# EAGLE design 12V_PowerSupply_V01 (EAGLE 9.2.0)
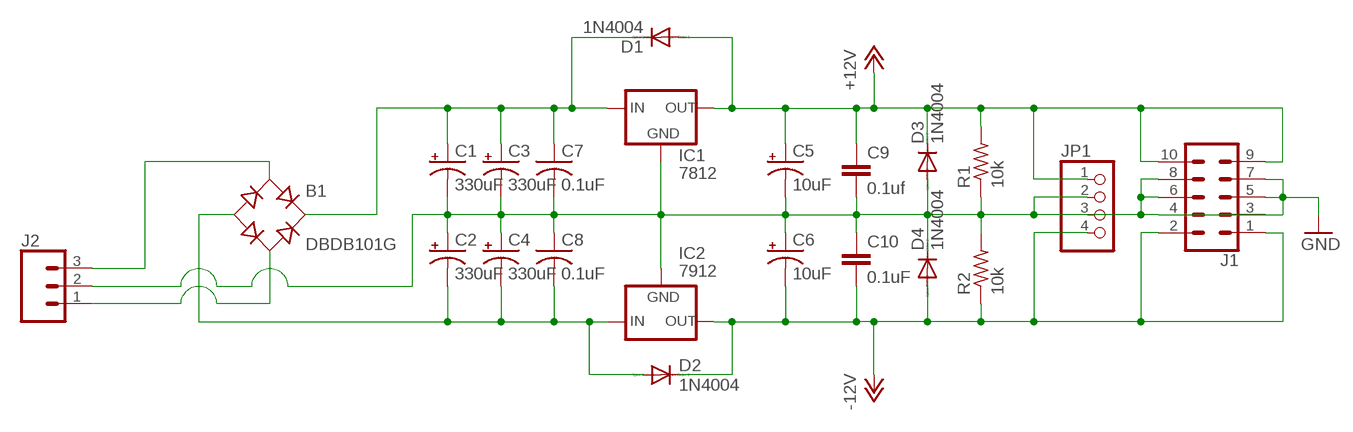
[diagram p0: schematic, sheet 1]

## Parts
B1  DBDB101G  [DB]
C1  330uF  CPOL-USE7.5-18  [E7,5-18]
C2  330uF  CPOL-USE7.5-18  [E7,5-18]
C3  330uF  CPOL-USE7.5-18  [E7,5-18]
C4  330uF  CPOL-USE7.5-18  [E7,5-18]
C5  10uF  CPOL-USE2.5-7  [E2,5-7]
C6  10uF  CPOL-USE2.5-7  [E2,5-7]
C7  0.1uF  C-US150-054X183  [C150-054X183]
C8  0.1uF  C-US150-054X183  [C150-054X183]
C9  0.1uf  C-EU050-025X075  [C050-025X075]
C10  0.1uF  C-EU050-025X075  [C050-025X075]
D1  1N4004  [DO41-10]
D2  1N4004  [DO41-10]
D3  1N4004  [DO41-10]
D4  1N4004  [DO41-10]
IC1  7812  78XXS  [78XXS]
IC2  7912  79XXS  [79XXS]
J1  CONN_05X2SHD  [2X5-SHROUDED]
J2  CONN_03-SCREW-5MM  [SCREWTERMINAL-5MM-3]
JP1  PINHD-1X4  [1X04]
R1  10k  R-US_0204/7  [0204/7]
R2  10k  R-US_0204/7  [0204/7]

## Nets
+12V: C5.+ C9.1 D1.A D3.C IC1.OUT J1.9 J1.10 JP1.1 R1.2
-12V: C6.- C10.2 D2.C D4.A IC2.OUT J1.1 J1.2 JP1.4 R2.1
GND: C1.- C2.+ C3.- C4.+ C5.- C6.+ C7.2 C8.1 C9.2 C10.1 D3.A D4.C IC1.GND IC2.GND J1.3 J1.4 J1.5 J1.6 J1.7 J1.8 J2.2 JP1.2 JP1.3 R1.1 R2.2
N$2: B1.+ C1.+ C3.+ C7.1 D1.C IC1.IN
N$3: B1.- C2.- C4.- C8.2 D2.A IC2.IN
N$4: B1.AC1 J2.3
N$5: B1.AC2 J2.1

## Library data of the parts
B1 = rectifier:DB?*G: Single Phase 1.0 AMP Glass Passivated Bridge Rectifier Taiwan Semiconductor Co.,Ltd. - TSC Source: http://www.taiwansemi.com/TSCbig5/ezcatfiles/cust/img/img/db101g.pdf http://www.ts.com.tw/db/pictures/modules/PDT/PDT060207001/DBLS201G.pdf
C1-C6 = rcl:CPOL-US: POLARIZED CAPACITOR, American symbol; SPICEPREFIX: C
C7 C8 = rcl:C-US: CAPACITOR, American symbol; SPICEPREFIX: C
C9 C10 = rcl:C-EU: CAPACITOR, European symbol; SPICEPREFIX: C
D1-D4 = diode:1N4004: DIODE general purpose rectifier, 1 A
IC1 = v-reg:78XXS: VOLTAGE REGULATOR
IC2 = v-reg:79XXS: VOLTAGE REGULATOR
J1 = SparkFun-Connectors:CONN_05X2: Multi connection point. Often used as Generic Header-pin footprint for 0.1 inch spaced/style header connections For AVR SPI programming port, see special device with nice symbol: "AVR_SPI_PROG_5x2.dev" You can populate with any combo of single row headers, but if you'd like an exact match, check these: 2x5 AVR ICSP Male Header <https://www.sparkfun.com/products/778> (PRT-00778) 2x5 Pin Shrouded Header <https://www.sparkfun.com/products/8506> (PRT-08506) On any of the 0.1 inch spaced packages, you can populate with these: Break Away Headers - Straight <https://www.sparkfun.com/products/116> (PRT-00116) Break Away Male Headers - Right Angle <https://www.sparkfun.com/products/553> (PRT-00553) Female Headers <https://www.sparkfun.com/products/115> (PRT-00115) Break Away Headers - Machine Pin <https://www.sparkfun.com/products/117> (PRT-00117) Break Away Female Headers - Swiss Machine Pin <https://www.sparkfun.com/products/743> (PRT-00743) Special note: the shrouded connector mates well with our 5x2 ribbon cables: 2x5 Pin IDC Ribbon Cable <https://www.sparkfun.com/products/8535> (PRT-08535); PROD_ID: CONN-08671; SF_ID: PRT-08506
J2 = SparkFun-Connectors:CONN_03: Multi connection point. Often used as Generic Header-pin footprint for 0.1 inch spaced/style header connections On any of the 0.1 inch spaced packages, you can populate with these: Break Away Headers - Straight <https://www.sparkfun.com/products/116> (PRT-00116) Break Away Male Headers - Right Angle <https://www.sparkfun.com/products/553> (PRT-00553) Female Headers <https://www.sparkfun.com/products/115> (PRT-00115) Break Away Headers - Machine Pin <https://www.sparkfun.com/products/117> (PRT-00117) Break Away Female Headers - Swiss Machine Pin <https://www.sparkfun.com/products/743> (PRT-00743) Stackable Header - 3 Pin (Female, 0.1") <https://www.sparkfun.com/products/13875> (PRT-13875) For SCREWTERMINALS and SPRING TERMINALS visit here: Screw Terimnals on SparkFun.com <https://www.sparkfun.com/search/results?term=Screw+Terminals> (5mm/3.5mm/2.54mm spacing) This device is also useful as a general connection point to wire up your design to another part of your project. Our various solder wires solder well into these plated through hole pads. Hook-Up Wire - Assortment (Stranded, 22 AWG) <https://www.sparkfun.com/products/11375> (PRT-11375) Hook-Up Wire - Assortment (Solid Core, 22 AWG) <https://www.sparkfun.com/products/11367> (PRT-11367) View the entire wire category on our website here <https://www.sparkfun.com/categories/141> Special notes: Molex polarized connector foot print use with SKU : PRT-08232 with associated crimp pins and housings.; PROD_ID: CONN-10134; SF_SKU: PRT-08433
JP1 = pinhead:PINHD-1X4: PIN HEADER
R1 R2 = resistor:R-US_: RESISTOR, American symbol

## Board
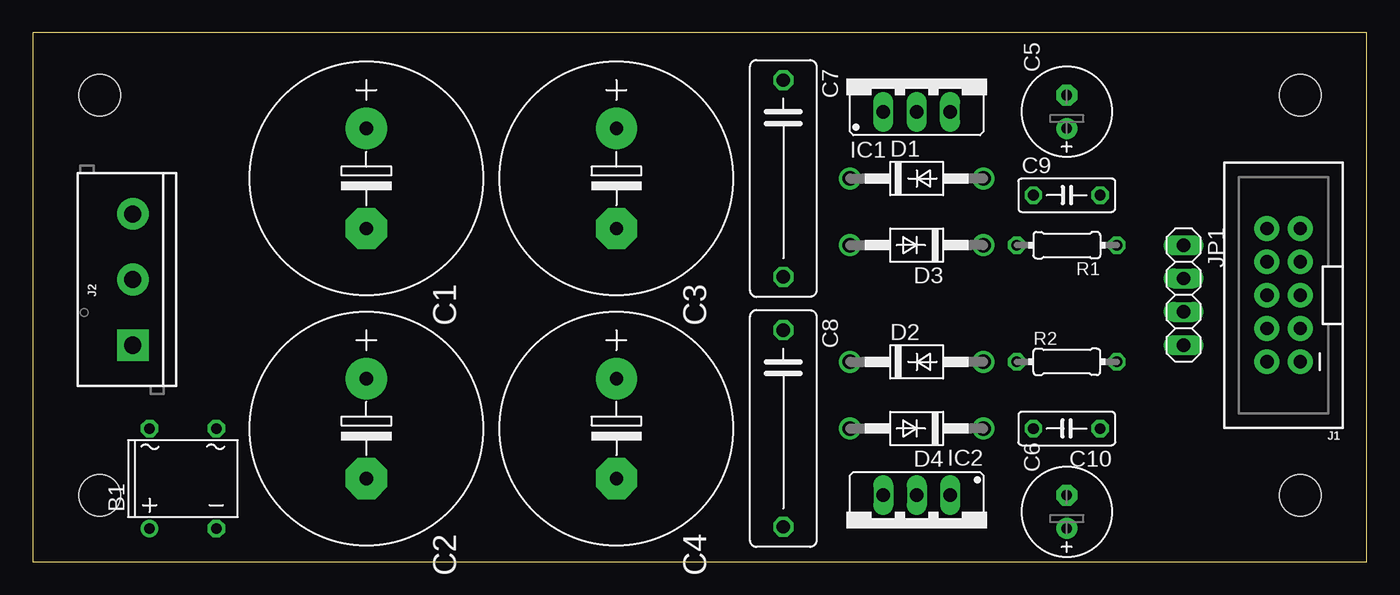
[diagram p1: board, top side]
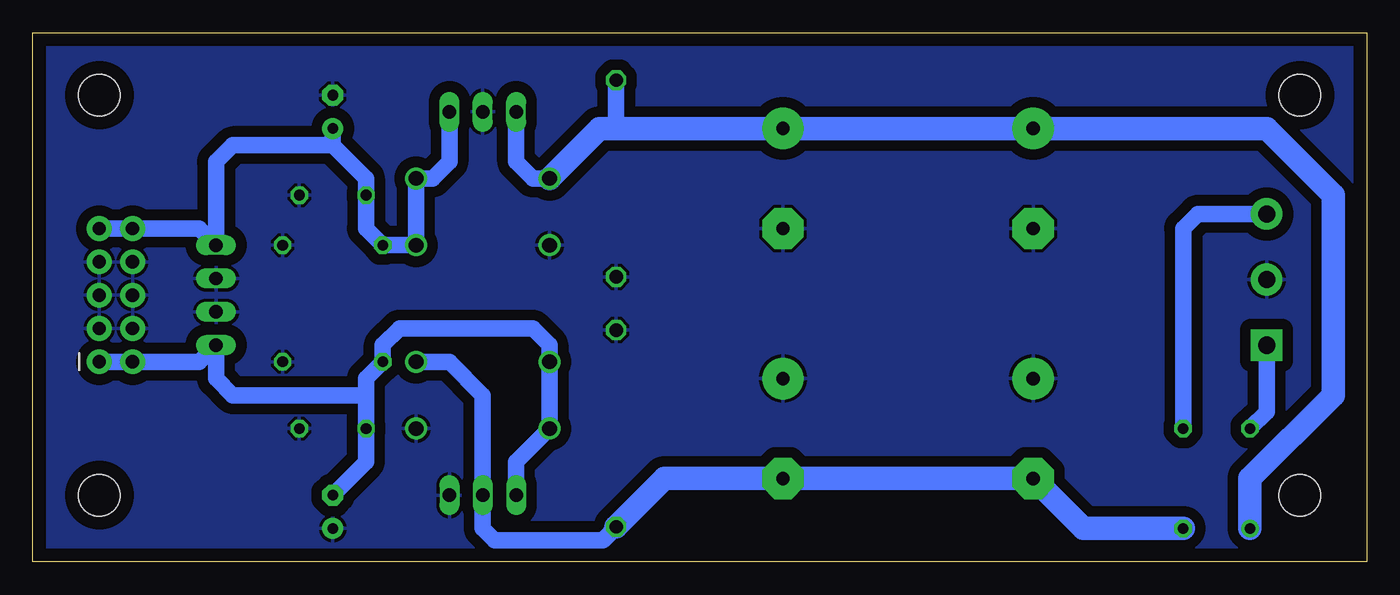
[diagram p2: board, bottom side, seen from below]

Size 101.58 x 40.31 mm. Coordinates in mm from the lower left corner, seen from the top.
Outline: 0,0 101.58,0 101.58,40.31 0,40.31 0,0
Copper layers (1*16): Top 0.035mm / dielectric 1.5mm / Bottom 0.035mm
Design rules "default": minimum track width 6mil, minimum drill 0.35mm, track to track 6mil, track to pad 6mil, pad to pad 6mil, via to via 6mil, smd to smd 6mil, copper to edge 40mil, drill to drill 6mil, minimum pad ring 10mil, minimum via ring 8mil, stop-mask expansion 4mil, vias tented up to drill 0mil, thermal gap 10mil
Holes 3.17 mm at 5.08,35.56 5.08,5.08 96.52,35.56 96.52,5.08

### Footprints (pad centres in the part's own frame; a part is rotated, then mirrored left to right if it is on the bottom)
DB = drill 0.813: + -2.54,-3.81 | drill 0.813 octagon: - 2.54,-3.81; AC1 2.54,3.81; AC2 -2.54,3.81
E7,5-18 = drill 1.016 pad 3.15: + -3.81,0 | drill 1.016 pad 3.15 octagon: - 3.81,0
E2,5-7 = drill 0.813 pad 1.6: + -1.27,0 | drill 0.813 pad 1.6 octagon: - 1.27,0
C150-054X183 = drill 1.016 octagon: 1 -7.493,0; 2 7.493,0
C050-025X075 = drill 0.813 octagon: 1 -2.54,0; 2 2.54,0
DO41-10 = drill 1.118: A 5.08,0; C -5.08,0
78XXS = drill 1.016 long: GND 0,-2.54; IN -2.54,-2.54; OUT 2.54,-2.54
79XXS = drill 1.016 long: GND -2.54,-2.54; IN 0,-2.54; OUT 2.54,-2.54
2X5-SHROUDED = drill 1.016 pad 1.88: 1 -1.27,5.08; 2 1.27,5.08; 3 -1.27,2.54; 4 1.27,2.54; 5 -1.27,0; 6 1.27,0; 7 -1.27,-2.54; 8 1.27,-2.54; 9 -1.27,-5.08; 10 1.27,-5.08
SCREWTERMINAL-5MM-3 = drill 1.3 pad 2.413 square: 1 0,0 | drill 1.3 pad 2.413: 2 5,0; 3 10,0
1X04 = drill 1.016 long: 1 -3.81,0; 2 -1.27,0; 3 1.27,0; 4 3.81,0
0204/7 = drill 0.813 octagon: 1 -3.81,0; 2 3.81,0

### Placement (x,y rotation side)
B1  11.43,6.35 0 top
C1  25.4,29.21 270 top
C2  25.4,10.16 270 top
C3  44.45,29.21 270 top
C4  44.45,10.16 270 top
C5  78.74,34.29 90 top
C6  78.74,3.81 90 top
C7  57.15,29.21 270 top
C8  57.15,10.16 270 top
C9  78.74,27.94 0 top
C10  78.74,10.16 180 top
D1  67.31,29.21 0 top
D2  67.31,15.24 0 top
D3  67.31,24.13 180 top
D4  67.31,10.16 180 top
IC1  67.31,36.83 0 top
IC2  67.31,2.54 180 top
J1  95.25,20.32 180 top
J2  7.62,16.51 90 top
JP1  87.63,20.32 270 top
R1  78.74,24.13 180 top
R2  78.74,15.24 0 top

### Tracks (layer width: path | path; a pad name or v marks a point on that pad's centre or on a via)
+12V
  Bottom 1.27: IC1.OUT 69.85,30.48 71.12,29.21 D1.A D3.C R1.2 76.2,25.4 C9.1 76.2,29.21 78.74,31.75 | C5.+ 78.74,31.75 | J1.9 J1.10 88.9,25.4 JP1.1 87.63,30.48 86.36,31.75 78.74,31.75
-12V
  Bottom 1.27: IC2.OUT 64.77,7.62 D4.A D2.C 62.23,16.51 63.5,17.78 73.66,17.78 74.93,16.51 R2.1 76.2,13.97 76.2,12.7 | C6.- 76.2,7.62 C10.2 76.2,12.7 | J1.1 J1.2 88.9,15.24 JP1.4 87.63,13.97 86.36,12.7 76.2,12.7
GND
  pour Bottom (isolate 0.813): 0,40.64 101.6,40.64 101.6,0 0,0
N$2
  Bottom 1.27: D1.C 63.5,29.21 64.77,30.48 IC1.IN | C7.1 57.15,33.02
  Bottom 1.778: B1.+ 8.89,6.35 2.54,12.7 2.54,27.94 7.62,33.02 C1.+ C3.+ 57.15,33.02 58.42,33.02 D1.C
N$3
  Bottom 1.27: D2.A 69.85,15.24 67.31,12.7 IC2.IN 67.31,2.54 66.42,1.65 58.17,1.65 C8.2
  Bottom 1.778: B1.- 21.59,2.54 C2.- C4.- 53.47,6.35 C8.2
N$4
  Bottom 1.27: J2.3 12.86,26.51 13.97,25.4 B1.AC1
N$5
  Bottom 1.27: B1.AC2 7.62,11.43 J2.1